# Altium schematic sheet debugging_board_3_KEY2.SchDoc
size A4
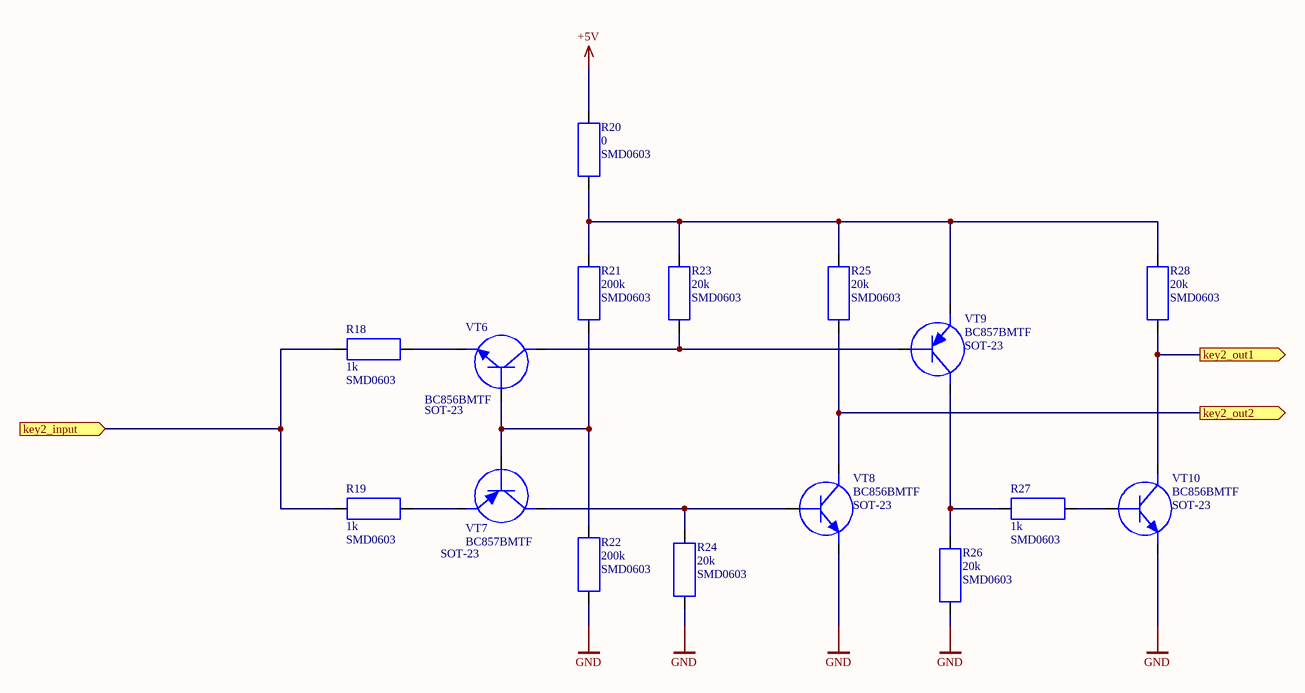
[diagram p0: debugging_board_3_KEY2.SchDoc]

## Parts
R18  1k  Package: SMD0603  [SMD0603(1005)]
R19  1k  Package: SMD0603  [SMD0603(1005)]
R20  0  Package: SMD0603  [SMD0603(1005)]
R21  200k  Package: SMD0603  [SMD0603(1005)]
R22  200k  Package: SMD0603  [SMD0603(1005)]
R23  20k  Package: SMD0603  [SMD0603(1005)]
R24  20k  Package: SMD0603  [SMD0603(1005)]
R25  20k  Package: SMD0603  [SMD0603(1005)]
R26  20k  Package: SMD0603  [SMD0603(1005)]
R27  1k  Package: SMD0603  [SMD0603(1005)]
R28  20k  Package: SMD0603  [SMD0603(1005)]
VT6  BC856BMTF  Package: SOT-23  [SOT23-3]
VT7  BC857BMTF  Package: SOT-23  [SOT23-3]
VT8  BC856BMTF  Package: SOT-23  [SOT23-3]
VT9  BC857BMTF  Package: SOT-23  [SOT23-3]
VT10  BC856BMTF  Package: SOT-23  [SOT23-3]

## Ports
key2_input (in), key2_out1 (out), key2_out2 (out)

## Nets
+5V: R20.1
GND: R22.2 R24.2 R26.2 VT8.2 VT10.2
key2_input: R18.2 R19.2 ; port key2_input
key2_out1: R28.2 VT10.3 ; port key2_out1
key2_out2: R25.2 VT8.3 ; port key2_out2
NetR18_1: R18.1 VT6.2
NetR19_1: R19.1 VT7.2
NetR20_2: R20.2 R21.1 R23.1 R25.1 R28.1 VT9.2
NetR21_2: R21.2 R22.1 VT6.1 VT7.1
NetR23_2: R23.2 VT6.3 VT9.1
NetR24_1: R24.1 VT7.3 VT8.1
NetR26_1: R26.1 R27.2 VT9.3
NetR27_1: R27.1 VT10.1

## Library data of the parts
R18 R19 R27 = R_0603: ValueBOM: Резистор 1кОм SMD 0603 1%; Type: R; Value: 1k
R20 = R_0603: ValueBOM: Резистор 0 Ом SMD 0603 1%; Type: R; Value: 0
R21 R22 = R_0603: ValueBOM: Резистор 200кОм SMD 0603 1%; Type: R; Value: 200k
R23-R26 R28 = R_0603: ValueBOM: Резистор 20кОм SMD 0603 1%; Type: R; Value: 20k
VT6 VT8 VT10 = VT_NPN_SOT23_3: Type: VT; ValueBOM: Транзистор биполярный NPN BC856BMTF SOT23; Value: BC856BMTF
VT7 VT9 = VT_PNP_SOT23_3: Type: VT; ValueBOM: Транзистор биполярный PNP BC857BMTF SOT23; Value: BC857BMTF